# EAGLE design trezor (EAGLE 6.4)
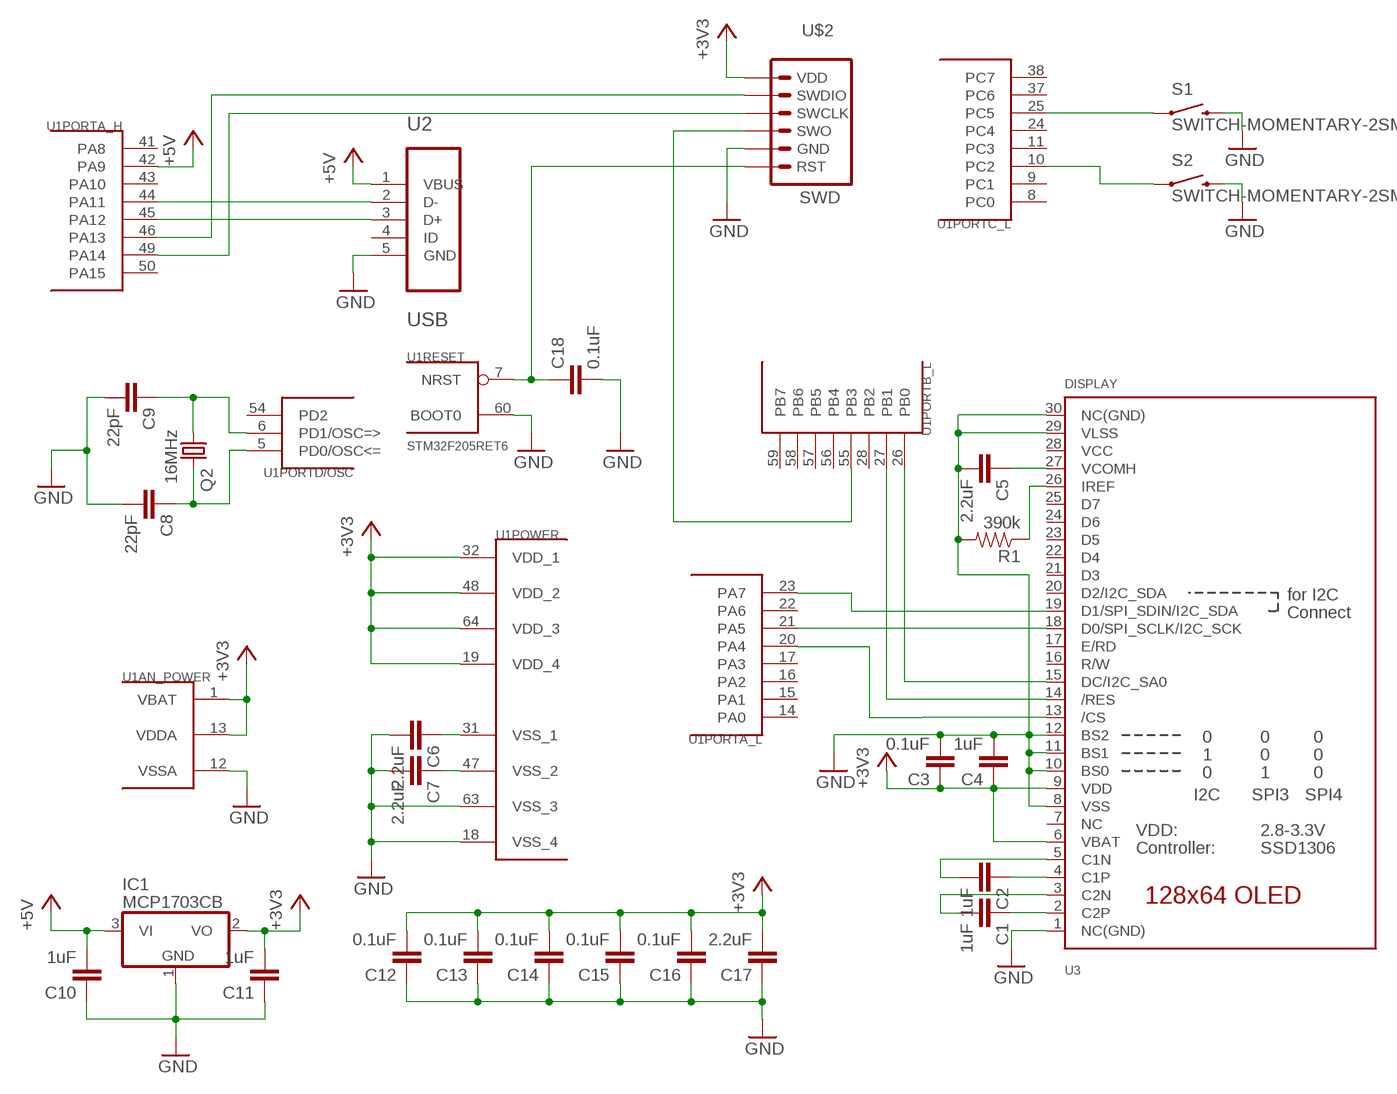
[diagram p0: schematic, sheet 1]

## Parts
C1  1uF  CAP0603-CAP  [0603-CAP]
C2  1uF  CAP0603-CAP  [0603-CAP]
C3  0.1uF  CAP0603-CAP  [0603-CAP]
C4  1uF  CAP0603-CAP  [0603-CAP]
C5  2.2uF  CAP0603-CAP  [0603-CAP]
C6  2.2uF  CAP0603-CAP  [0603-CAP]
C7  2.2uF  CAP0603-CAP  [0603-CAP]
C8  22pF  CAP0603-CAP  [0603-CAP]
C9  22pF  CAP0603-CAP  [0603-CAP]
C10  1uF  CAP0603-CAP  [0603-CAP]
C11  1uF  CAP0603-CAP  [0603-CAP]
C12  0.1uF  CAP0603-CAP  [0603-CAP]
C13  0.1uF  CAP0603-CAP  [0603-CAP]
C14  0.1uF  CAP0603-CAP  [0603-CAP]
C15  0.1uF  CAP0603-CAP  [0603-CAP]
C16  0.1uF  CAP0603-CAP  [0603-CAP]
C17  2.2uF  CAP0603-CAP  [0603-CAP]
C18  0.1uF  CAP0603-CAP  [0603-CAP]
IC1  MCP1703CB  [SOT23]
Q2  16MHz  CRYSTALCTS406  [CTS406]
R1  390k  RESISTOR0603-RES  [0603-RES]
S1  SWITCH-MOMENTARY-2SMD  [TACTILE_SWITCH_SMD]
S2  SWITCH-MOMENTARY-2SMD  [TACTILE_SWITCH_SMD]
U1  STM32F205RET6  STM32F10XRXT6  [TQFP64]
U2  USB  47346-0001  [MOLEX_47346-0001]
U3  DISPLAY  DISP_OLED_UG-2864HSWEG010.96"  [UG-2864HSWEG01_0.96IN_WRAPAROUND]
U$2  SWD  [SWD]

## Nets
+3V3: C3.1 C4.1 C11.2 C12.2 C13.2 C14.2 C15.2 C16.2 C17.2 IC1.2(VO) U1.1(AN_POWER:VBAT) U1.13(AN_POWER:VDDA) U1.19(POWER:VDD_4) U1.32(POWER:VDD_1) U1.48(POWER:VDD_2) U1.64(POWER:VDD_3) U3.6(VBAT) U3.9(VDD) U$2.6(VDD)
+5V: C10.2 IC1.3(VI) U1.42(PORTA_H:PA9) U2.1(VBUS)
GND: C3.2 C4.2 C5.2 C6.2 C7.2 C8.2 C9.2 C10.1 C11.1 C12.1 C13.1 C14.1 C15.1 C16.1 C17.1 C18.2 IC1.1(GND) R1.2 S1.3 S2.3 U1.12(AN_POWER:VSSA) U1.18(POWER:VSS_4) U1.60(RESET:BOOT0) U1.63(POWER:VSS_3) U2.5(GND) U3.1(NC(GND)) U3.8(VSS) U3.10(BS0) U3.11(BS1) U3.12(BS2) U3.29(VLSS) U3.30(NC(GND)) U$2.2(GND)
N$1: U1.23(PORTA_L:PA7) U3.19(D1/SPI_SDIN/I2C_SDA)
N$2: C18.1 U1.7(RESET:NRST) U$2.1(RST)
N$3: U1.26(PORTB_L:PB0) U3.15(DC/I2C_SA0)
N$4: C6.1 U1.31(POWER:VSS_1)
N$5: U1.21(PORTA_L:PA5) U3.18(D0/SPI_SCLK/I2C_SCK)
N$6: C5.1 U3.27(VCOMH)
N$7: U1.27(PORTB_L:PB1) U3.14(/RES)
N$8: C7.1 U1.47(POWER:VSS_2)
N$9: R1.1 U3.26(IREF)
N$10: C1.1 U3.2(C2P)
N$11: C2.1 U3.4(C1P)
N$12: C1.2 U3.3(C2N)
N$13: C2.2 U3.5(C1N)
N$14: U1.55(PORTB_L:PB3) U$2.3(SWO)
N$15: U1.46(PORTA_H:PA13) U$2.5(SWDIO)
N$16: U1.20(PORTA_L:PA4) U3.13(/CS)
N$17: U1.49(PORTA_H:PA14) U$2.4(SWCLK)
N$19: S1.1 U1.25(PORTC_L:PC5)
N$20: S2.1 U1.10(PORTC_L:PC2)
USB_D_N: U1.44(PORTA_H:PA11) U2.2(D-)
USB_D_P: U1.45(PORTA_H:PA12) U2.3(D+)
XTAL1: C9.1 Q2.1 U1.6(PORTD/OSC:PD1/OSC=>)
XTAL2: C8.1 Q2.3 U1.5(PORTD/OSC:PD0/OSC<=)
Unconnected: U1.2(PORTC_H:PC13) U1.3(PORTC_H:PC14) U1.4(PORTC_H:PC15) U1.8(PORTC_L:PC0) U1.9(PORTC_L:PC1) U1.11(PORTC_L:PC3) U1.14(PORTA_L:PA0) U1.15(PORTA_L:PA1) U1.16(PORTA_L:PA2) U1.17(PORTA_L:PA3) U1.22(PORTA_L:PA6) U1.24(PORTC_L:PC4) U1.28(PORTB_L:PB2) U1.29(PORTB_H:PB10) U1.30(PORTB_H:PB11) U1.33(PORTB_H:PB12) U1.34(PORTB_H:PB13) U1.35(PORTB_H:PB14) U1.36(PORTB_H:PB15) U1.37(PORTC_L:PC6) U1.38(PORTC_L:PC7) U1.39(PORTC_H:PC8) U1.40(PORTC_H:PC9) U1.41(PORTA_H:PA8) U1.43(PORTA_H:PA10) U1.50(PORTA_H:PA15) U1.51(PORTC_H:PC10) U1.52(PORTC_H:PC11) U1.53(PORTC_H:PC12) U1.54(PORTD/OSC:PD2) U1.56(PORTB_L:PB4) U1.57(PORTB_L:PB5) U1.58(PORTB_L:PB6) U1.59(PORTB_L:PB7) U1.61(PORTB_H:PB8) U1.62(PORTB_H:PB9) U2.4(ID) U3.7(NC) U3.16(R/W) U3.17(E/RD) U3.20(D2/I2C_SDA) U3.21(D3) U3.22(D4) U3.23(D5) U3.24(D6) U3.25(D7)

## Power pins joined to a net without a drawn wire
VCC: U3.28(VCC)

## Library data of the parts
C1-C18 = SparkFun-Passives:CAP: Capacitor Standard 0603 ceramic capacitor, and 0.1" leaded capacitor.
IC1 = linear:MCP1703: 250 mA, 16V, Low Quiescent Current LDO Regulator Source: http://ww1.microchip.com/downloads/en/DeviceDoc/22049b.pdf
Q2 = crystal:CRYSTAL: CRYSTAL
R1 = SparkFun-Passives:RESISTOR: Resistor Basic schematic elements and footprints for 0603, 1206, and PTH resistors.
S1 S2 = SparkFun-Electromechanical:SWITCH-MOMENTARY-2: Various NO switches- pushbuttons, reed, etc
U1 = stm32:STM32F10XRXT6: STM32F101/103 64pin LQFP
U2 = fabhack:47346-0001: CONN RCPT 5POS MICRO USB R/A SMD; MPN: 47346-0001; OC_FARNELL: 1568026; OC_NEWARK: 47M0505; PACKAGE: 5 POS MICRO USB R/A; SUPPLIER: MOLEX
U3 = microbuilder:DISP_OLED_UG-2864HSWEG01: UG-2864HSWEG01 OLED display Both 1.3" and 0.96" models share the same FPC tab footprint, only the screen dimensions vary.
U$2 = fabhack:SWD: SWD Miniature connector for ARM programming.

## Board
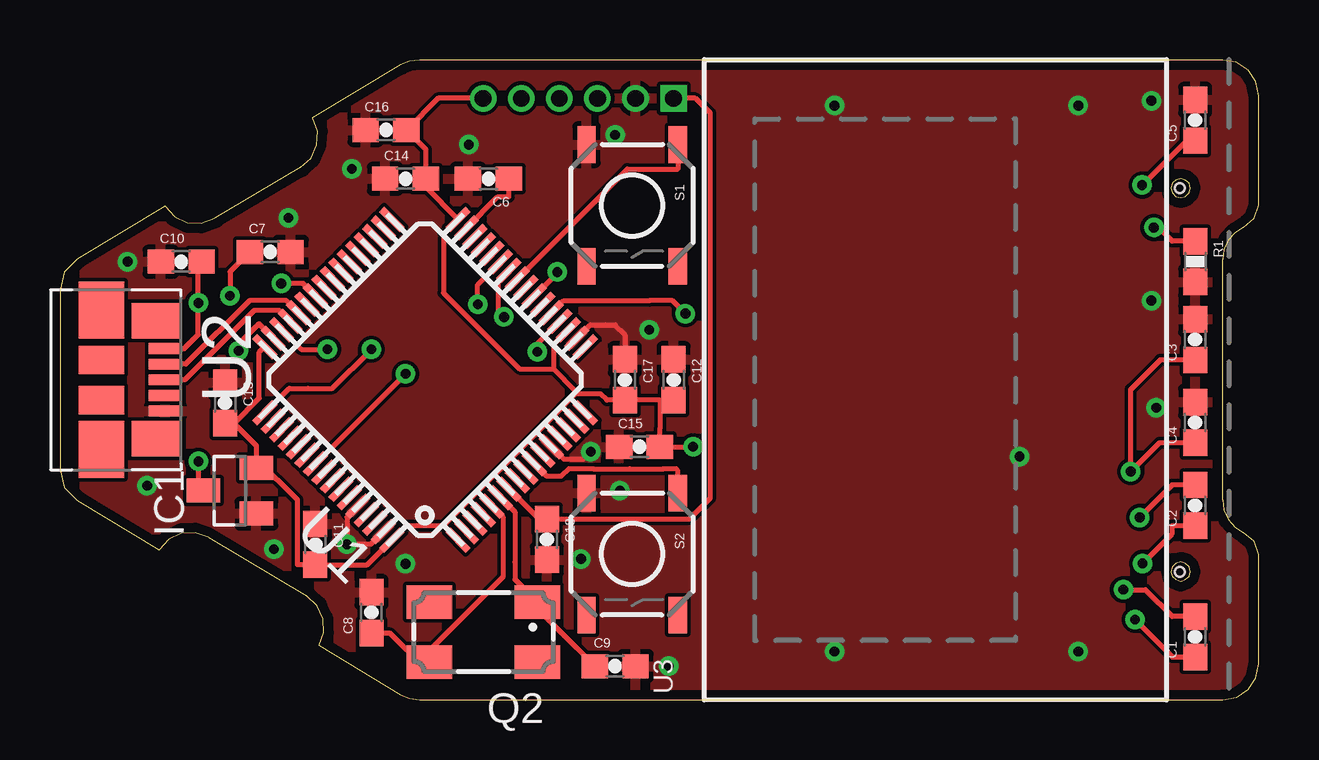
[diagram p1: board, top side]
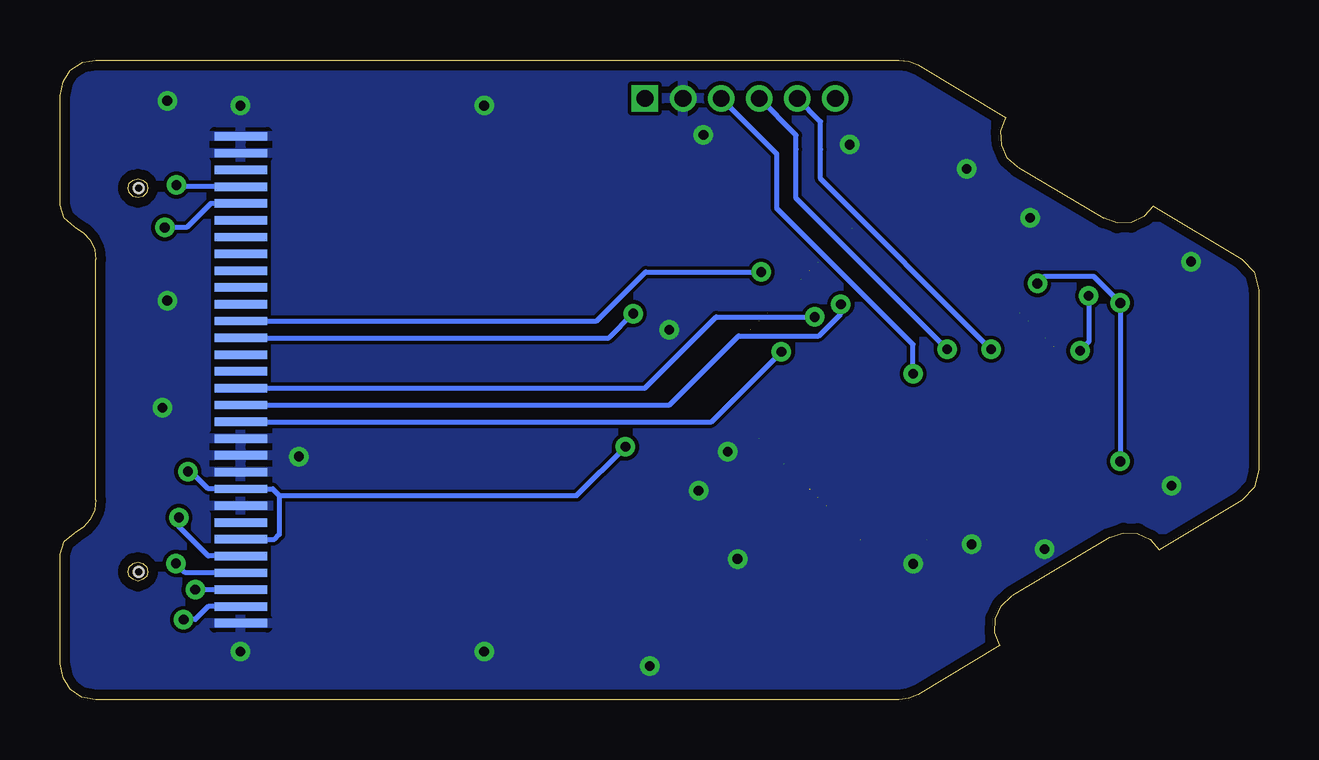
[diagram p2: board, bottom side, seen from below]

Size 49.96 x 26.67 mm. Coordinates in mm from the lower left corner, seen from the top.
Outline: 47.12,5.33 47.07,5.54 46.91,5.69 46.71,5.74 46.51,5.69 46.35,5.54 46.3,5.33 46.35,5.13 46.51,5 46.71,4.93 46.91,5 47.07,5.13 47.12,5.33
Outline: 47.12,21.34 47.07,21.54 46.91,21.67 46.71,21.72 46.51,21.67 46.35,21.54 46.3,21.34 46.35,21.13 46.51,20.98 46.71,20.93 46.91,20.98 47.07,21.13 47.12,21.34
Outline: 4.39,20.57 0.71,18.36 0.18,17.83 0,17.07 0,9.58 0.18,8.84 0.71,8.31 4.14,6.25 4.52,6.68 5.05,6.93 5.64,6.96 6.2,6.76 10.29,4.32 10.72,3.91 10.97,3.38 11,2.79 10.79,2.26 14.2,0.2 14.58,0.05 14.99,0 48.46,0 49.05,0.1 49.53,0.43 49.83,0.91 49.96,1.5 49.96,6.05 49.78,6.6 49.35,6.96 49,7.19 48.69,7.52 48.51,7.9 48.46,8.33 48.46,18.34 48.51,18.77 48.69,19.15 49,19.48 49.35,19.71 49.78,20.07 49.96,20.62 49.96,25.17 49.83,25.76 49.53,26.24 49.02,26.57 48.46,26.67 14.99,26.67 14.58,26.62 14.2,26.47 10.54,24.26 10.74,23.7 10.69,23.11 10.46,22.58 10.03,22.2 6.45,20.07 5.89,19.86 5.31,19.89 4.78,20.14 4.39,20.57
Copper layers (1*16): Top 0.035mm / dielectric 1.5mm / Bottom 0.035mm
Design rules "default *": minimum track width 8mil, minimum drill 16mil, track to track 6mil, track to pad 6mil, pad to pad 6mil, via to via 6mil, smd to smd 6mil, copper to edge 16mil, drill to drill 8mil, minimum pad ring 8mil, minimum via ring 8mil, stop-mask expansion 4mil, vias tented up to drill 0mil, thermal gap 8mil

### Footprints (pad centres in the part's own frame; a part is rotated, then mirrored left to right if it is on the bottom)
0603-CAP = smd 1.1 x 1: 1 -0.85,0; 2 0.85,0
SOT23 = smd 1 x 1.4: 1 -0.95,-1.1; 2 0.95,-1.1; 3 0,1.1
CTS406 = smd 1.9 x 1.4: 1 -2.25,-1.25; 2 2.25,-1.25; 3 2.25,1.25; 4 -2.25,1.25
0603-RES = smd 1.1 x 1: 1 -0.85,0; 2 0.85,0
TACTILE_SWITCH_SMD = smd 1.524 x 0.762: 1 -2.54,1.905; 2 2.54,1.905; 3 -2.54,-1.905; 4 2.54,-1.905
TQFP64 = smd 1.2 x 0.3: 1 -5.7,3.75; 2 -5.7,3.25; 3 -5.7,2.75; 4 -5.7,2.25; 5 -5.7,1.75; 6 -5.7,1.25; 7 -5.7,0.75; 8 -5.7,0.25; 9 -5.7,-0.25; 10 -5.7,-0.75; 11 -5.7,-1.25; 12 -5.7,-1.75; 13 -5.7,-2.25; 14 -5.7,-2.75; 15 -5.7,-3.25; 16 -5.7,-3.75; 33 5.7,-3.75; 34 5.7,-3.25; 35 5.7,-2.75; 36 5.7,-2.25; 37 5.7,-1.75; 38 5.7,-1.25; 39 5.7,-0.75; 40 5.7,-0.25; 41 5.7,0.25; 42 5.7,0.75; 43 5.7,1.25; 44 5.7,1.75; 45 5.7,2.25; 46 5.7,2.75; 47 5.7,3.25; 48 5.7,3.75 | smd 0.3 x 1.2: 17 -3.75,-5.7; 18 -3.25,-5.7; 19 -2.75,-5.7; 20 -2.25,-5.7; 21 -1.75,-5.7; 22 -1.25,-5.7; 23 -0.75,-5.7; 24 -0.25,-5.7; 25 0.25,-5.7; 26 0.75,-5.7; 27 1.25,-5.7; 28 1.75,-5.7; 29 2.25,-5.7; 30 2.75,-5.7; 31 3.25,-5.7; 32 3.75,-5.7; 49 3.75,5.7; 50 3.25,5.7; 51 2.75,5.7; 52 2.25,5.7; 53 1.75,5.7; 54 1.25,5.7; 55 0.75,5.7; 56 0.25,5.7; 57 -0.25,5.7; 58 -0.75,5.7; 59 -1.25,5.7; 60 -1.75,5.7; 61 -2.25,5.7; 62 -2.75,5.7; 63 -3.25,5.7; 64 -3.75,5.7
MOLEX_47346-0001 = smd 0.45 x 1.38: 1 -1.3,0; 2 -0.65,0; 3 0,0; 4 0.65,0; 5 1.3,0 | smd 1.475 x 2.1: M1 -2.462,-0.36; M2 2.462,-0.36 | smd 2.375 x 1.9: M3 -2.913,-2.66; M6 2.913,-2.66 | smd 1.175 x 1.9: M4 -0.82,-2.66; M5 0.85,-2.66
UG-2864HSWEG01_0.96IN_WRAPAROUND = smd 0.35 x 2.2 bottom: 1 -10.15,-1.2; 2 -9.45,-1.2; 3 -8.75,-1.2; 4 -8.05,-1.2; 5 -7.35,-1.2; 6 -6.65,-1.2; 7 -5.95,-1.2; 8 -5.25,-1.2; 9 -4.55,-1.2; 10 -3.85,-1.2; 11 -3.15,-1.2; 12 -2.45,-1.2; 13 -1.75,-1.2; 14 -1.05,-1.2; 15 -0.35,-1.2; 16 0.35,-1.2; 17 1.05,-1.2; 18 1.75,-1.2; 19 2.45,-1.2; 20 3.15,-1.2; 21 3.85,-1.2; 22 4.55,-1.2; 23 5.25,-1.2; 24 5.95,-1.2; 25 6.65,-1.2; 26 7.35,-1.2; 27 8.05,-1.2; 28 8.75,-1.2; 29 9.45,-1.2; 30 10.15,-1.2 | hole 0.4: -8,-5.45; 8,-5.45
SWD = drill 0.7 square: 1 0,0 | drill 0.7: 2 1.587,0; 3 3.175,0; 4 4.763,0; 5 6.35,0; 6 7.938,0

### Placement (x,y rotation side)
C1  47.32,2.62 90 top
C2  47.32,8.1 90 top
C3  47.32,15.01 90 top
C4  47.32,11.56 90 top
C5  47.32,24.16 90 top
C6  17.86,21.72 180 top
C7  8.76,18.67 0 top
C8  12.98,3.63 90 top
C9  23.14,1.4 0 top
C10  5.05,18.26 0 top
C11  10.64,6.48 270 top
C12  25.58,13.34 270 top
C13  6.88,12.37 270 top
C14  14.4,21.72 0 top
C15  24.16,10.54 0 top
C16  13.59,23.75 0 top
C17  23.55,13.34 270 top
C18  20.29,6.68 270 top
IC1  7.09,8.71 90 top
Q2  17.65,2.82 180 top
R1  47.32,18.26 270 top
S1  23.85,20.6 270 top
S2  23.85,6.07 270 top
U1  15.21,13.34 135 top
U2  4.39,13.34 270 top
U3  41.22,13.34 90 top
U$2  25.58,25.07 180 top

### Tracks (layer width: path | path; a pad name or v marks a point on that pad's centre or on a via)
+3V3  (via drill 0.41, 0.41 pad 0.81)  (5 unrouted)
  Top 0.203: 21.48,12.75 20.23,11.5 | 21.48,12.75 22.53,12.75 22.79,12.48 C17.2 25.01,12.48 | 21.48,12.75 21.48,12.89 20.59,13.79 | 20.59,13.79 20.59,14.82 U1.19 | 20.59,13.79 19.16,13.79 15.99,16.96 15.99,19.41 U1.32 | 15.99,7.26 20.23,11.5 | 20.23,11.5 | 15.99,7.26 14.44,7.26 U1.64 12.81,5.63 C11.2 9.89,5.63 9.89,8.34 8.19,10.04 | 15.99,7.26 | U1.13 20.23,11.5 | U1.1 15.99,7.26 | 7.26,11.52 8.31,12.57 8.31,14.49 U1.48 | 7.26,11.52 8.19,10.59 8.19,10.04 | C13.2 7.26,11.52 | U1.32 | 25.01,12.48 C12.2 | 25.01,12.48 25.01,11.29 C15.2 v26.39,10.54 | IC1.2 8.19,10.04 | C4.1 45.83,10.71 v44.63,9.51 44.63,12.93 45.86,14.16 C3.1 | U$2.6 15.76,25.07 C16.2 15.25,22.94 C14.2 15.25,21.36 U1.32
  Bottom 0.203: v44.63,9.51 44.5,9.51 43.78,8.78 43.69,8.78 U3.9 41.09,8.78 40.82,8.51 | 40.82,8.51 40.82,6.88 41.02,6.68 U3.6 | 40.82,8.51 28.42,8.51 v26.39,10.54
+5V  (via drill 0.41 pad 0.81)
  Top 0.203: 5.87,8.83 IC1.3 5.77,8.93 v5.77,9.93 | U2.1 5.19,14.63 5.77,15.21 v5.77,16.54 5.77,18.12 C10.2 | U1.42 10.14,17.35 v9.22,17.35
  Bottom 0.203: v5.77,9.93 v5.77,16.54 6.88,17.65 8.92,17.65 v9.22,17.35
GND  (via drill 0.41)
  Top 0.203: U1.63 12.95,6.48 v11.96,6.48 11.96,7.61 U1.60 | U1.18 22.1,15.62 22.73,15.62 23.14,15.62 23.55,15.21 C17.1 | U1.12 20.5,10.54 21.01,10.03 21.82,10.03 v22.12,10.34
  other vias: 40.01,10.13 45.49,24.97 42.44,24.77 45.49,16.64 45.69,12.17 12.17,22.12 23.14,23.55 17.04,23.14 9.53,20.09 2.82,18.26 8.92,6.27 14.4,5.66 23.34,8.71 24.56,15.42 32.28,24.77 32.28,2.01 25.37,1.4 21.72,5.87 3.63,8.92 42.44,2.01
  pour Bottom: 50.98,27 -1.04,27 -1.04,-0.43 50.98,-0.43
  pour Top: -1.04,27 50.98,27 50.98,-0.43 -1.04,-0.43
N$1  (via drill 0.41 pad 0.81)
  Top 0.203: U1.23 | v20.73,17.83 20.73,17.79 U1.23
  Bottom 0.203: U3.19 27.59,15.78 25.55,17.83 v20.73,17.83
N$2  (1 unrouted)
  Top 0.203: U1.7 19.96,7.53 C18.1 26.23,7.53 27.1,8.4 27.1,24.45 26.49,25.07 U$2.1
N$3  (via drill 0.41 pad 0.81)  (1 unrouted)
  Top 0.203: U1.26 18.26,17.44 18.26,16.64 18.26,16.2 v18.51,15.96
  Bottom 0.203: U3.15 25.59,12.98 22.62,15.96 v18.51,15.96
N$4  (1 unrouted)
  Top 0.203: C6.1 18.71,20.96 18.25,20.96 U1.31
N$5  (via drill 0.41 pad 0.81)  (1 unrouted)
  Top 0.203: U1.21 20.99,16.64 24.56,16.64 25.53,16.64 v26.07,16.09
  Bottom 0.203: U3.18 27.08,15.08 v26.07,16.09
N$6  (via drill 0.41 pad 0.81)
  Top 0.203: C5.1 46.96,23.31 v45.11,21.45
  Bottom 0.203: U3.27 45.04,21.38 v45.11,21.45
N$7  (via drill 0.41 pad 0.81)  (1 unrouted)
  Top 0.203: v17.41,16.48 17.41,17.3 U1.27
  Bottom 0.203: U3.14 24.55,12.28 21.67,15.16 18.33,15.16 17.41,16.08 v17.41,16.48
N$8  (via drill 0.41, 0.41 pad 0.81)  (1 unrouted)
  Top 0.203: U1.47 8.28,15.67 8.15,15.54 | 8.15,15.54 | 8.15,15.54 7.45,14.83 v7.45,14.55 | C7.1 7.09,17.84 v7.09,16.84
  Bottom 0.203: v7.09,16.84 7.09,14.91 v7.45,14.55
N$9  (via drill 0.41 pad 0.81)
  Top 0.203: R1.1 46.36,19.11 45.79,19.68 v45.6,19.68
  Bottom 0.203: v45.6,19.68 44.68,19.68 43.68,20.68 U3.26
N$10  (via drill 0.41 pad 0.81)
  Top 0.203: C1.1 46.36,1.77 46.36,1.79 v44.81,3.34
  Bottom 0.203: U3.2 43.78,3.88 44.32,3.34 v44.81,3.34
N$11  (via drill 0.41 pad 0.81)
  Top 0.203: C2.1 46.36,7.25 46.36,6.91 v45.13,5.68
  Bottom 0.203: U3.4 44.74,5.28 v45.13,5.68
N$12  (via drill 0.41 pad 0.81)
  Top 0.203: C1.2 46.36,3.47 45.24,4.58 v44.33,4.58
  Bottom 0.203: U3.3 v44.33,4.58
N$13  (via drill 0.41 pad 0.81)
  Top 0.203: C2.2 46.36,8.95 45.61,8.2 v45.01,7.59
  Bottom 0.203: U3.5 43.78,5.98 45.01,7.21 v45.01,7.59
N$14  (via drill 0.41)
  Top 0.203: U1.55 13.79,12.97 v14.4,13.58 v14.4,13.59
  Bottom 0.203: U$2.3 20.09,22.76 20.09,20.5 14.4,14.81 v14.4,13.59
N$15  (via drill 0.41)
  Top 0.203: U1.46 10.06,14.6 v11.15,14.6
  Bottom 0.203: v11.15,14.6 18.26,21.72 18.26,22.94 18.26,24.1 U$2.5
N$16  (via drill 0.41 pad 0.81)  (1 unrouted)
  Top 0.203: v19.89,14.5 19.89,14.83 U1.20
  Bottom 0.203: U3.13 22.81,11.58 v19.89,14.5
N$17  (via drill 0.41)
  Top 0.203: U1.49 9.56,12.98 10.34,12.98 11.35,12.98 v12.98,14.6
  Bottom 0.203: v12.98,14.6 19.28,20.9 19.28,22.94 19.28,23.53 U$2.4
N$19  (1 unrouted)
  Top 0.203: S1.1 25.76,22.12 23.65,22.12 U1.25
N$20  (1 unrouted)
  Top 0.203: U1.10 20.29,9.32 20.9,9.32 21.21,9.63 22.22,9.63 23.75,9.63 25.15,9.63 25.68,9.63 25.76,9.55 S2.1
USB_D_N  (1 unrouted)
  Top 0.203: U1.44 9.44,16.64 7.9,16.64 5.25,13.98 U2.2
USB_D_P  (1 unrouted)
  Top 0.203: U1.45 9.14,16.23 8.1,16.23 5.21,13.33 U2.3
XTAL1  (1 unrouted)
  Top 0.203: U1.6 18.97,7.82 | 18.97,7.82 | 18.97,7.82 18.97,5.73 18.97,5.01 Q2.1 19.9,3.78 20.57,3.12 21.54,2.15 C9.1
XTAL2  (1 unrouted)
  Top 0.203: U1.5 18.46,7.61 18.46,5.11 15.4,2.05 | C8.1 13.73,2.78 14.47,2.05 15.4,2.05 | Q2.3 15.4,2.05